# Altium schematic sheet MAX30102_Heart-Rate_Sensor.SchDoc: MAX30102 Heart-Rate Sensor
size A4; DocumentNumber: 9; SheetNumber: 9; SheetTotal: 31
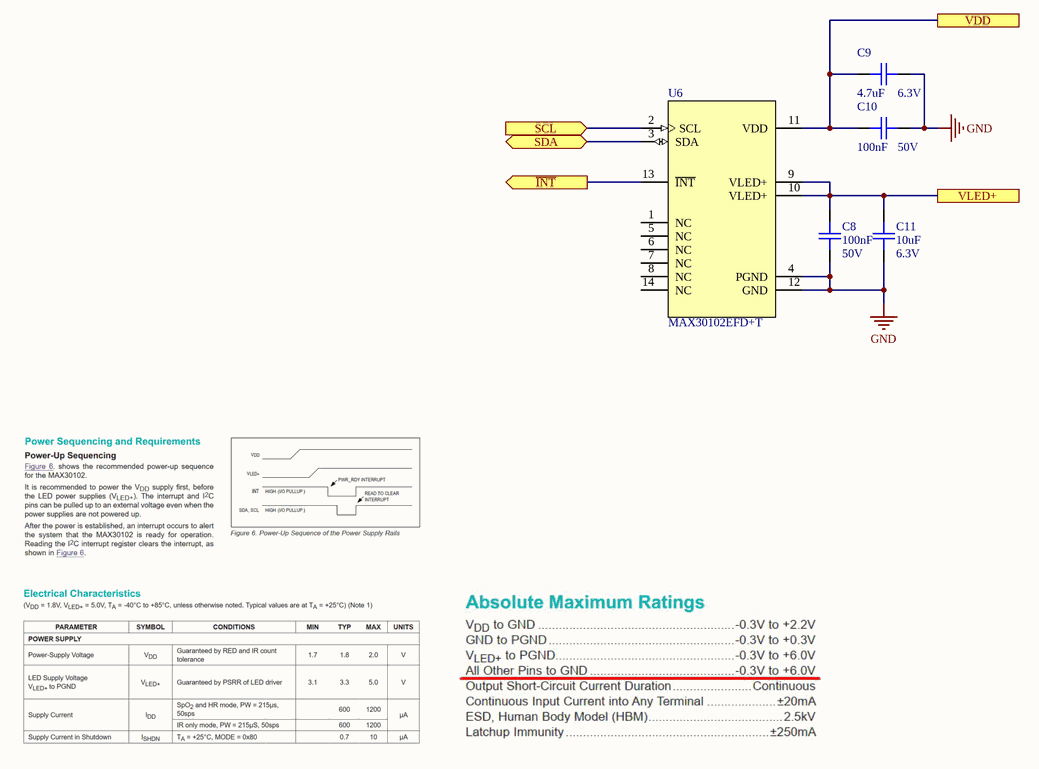
[diagram p0: MAX30102_Heart-Rate_Sensor.SchDoc]

## Parts
C8  Capacitance: 100nF  Voltage: 50V  [C0402]  (hidden comment: CAP CER 0.1UF 50V X7R 0402)
C9  Capacitance: 4.7uF  Voltage Rating: 6.3V  [C0402]  (hidden comment: CAP CER 4.7UF 6.3V X5R 0402)
C10  Capacitance: 100nF  Voltage: 50V  [C0402]  (hidden comment: CAP CER 0.1UF 50V X7R 0402)
C11  Capacitance: 10uF  Voltage Rating: 6.3V  [C0402]  (hidden comment: CAP CER 10UF 6.3V X5R 0402)
U6  MAX30102EFD+T  [XDCR_MAX30101EFD+]

## Ports
SCL (in), SDA (bidir), VDD, VLED+, ~{INT} (out)

## Nets
GND: C8.1 C9.2 C10.2 C11.1 U6.4(PGND) U6.12(GND)
~{INT}: U6.13(~{INT}) ; port ~{INT}
SCL: U6.2(SCL) ; port SCL
SDA: U6.3(SDA) ; port SDA
VDD: C9.1 C10.1 U6.11(VDD) ; port VDD
VLED+: C8.2 C11.2 U6.9(VLED+) U6.10(VLED+) ; port VLED+

Not connected (* = marked no-connect by the designer): U6 1(NC) 5(NC) 6(NC) 7(NC) 8(NC) 14(NC)

## Notes on the sheet
- Title
- Size:
- Date:
- A4
- Number:
- Time:
- Revision:
- Sheet
- of
- File:

## Library data of the parts
C8 C10 = CAP CER 0.1UF 50V X7R 0402: 0.1µF ±10% 50V Ceramic Capacitor X7R 0402 (1005 Metric); Manufacturer: TDK; Manufacturer Part Number: CGA2B3X7R1H104K050BB; Supplier 1: Digi-Key; Stock 1: 2925303; Pricing 1: 1=0.17, 10=0.118, 50=0.0668, 100=0.0553, 500=0.0388, 1000=0.0321, 2500=0.0299, 5000=0.0273 (USD); Mount: Surface Mount; Case/Package: 0402; Weight: 2.3E-05oz; Case Code (Metric): 1005; Case Code (Imperial): 0402; Min Operating Temperature: -55°C; Max Operating Temperature: 125°C; Voltage Rating: 50V; Tolerance: 10%; Packaging: Tape and Reel; Package Quantity: 1; Voltage Rating (DC): 50V; Dielectric: X7R; Termination: SMD/SMT; Composition: Ceramic; Length: 1mm; Height: 0.5mm; Width: 0.02inch; Thickness: 0.022inch; Depth: 0.5mm; Ratings: AEC-Q200; REACH SVHC: No SVHC; Lead Free: Lead Free; ComponentLink1URL: http://product.tdk.com/capacitor/mlcc/en/documents/mlccspec_automotive_general_midvoltage_en.pdf?src-supplier=Future+Electronics; ComponentLink1Description: http://product.tdk.com/capacitor/mlcc/en/documents/mlccspec_automotive_general_midvoltage_en.pdf?src-supplier=Future+Electronics; ComponentLink2URL: http://www.farnell.com/datasheets/1807242.pdf?src-supplier=Element14; ComponentLink2Description: http://www.farnell.com/datasheets/1807242.pdf?src-supplier=Element14; ComponentLink3URL: http://www.mouser.com/ds/2/400/lcc_automotive_general_en-843974.pdf?src-supplier=Mouser; ComponentLink3Description: http://www.mouser.com/ds/2/400/lcc_automotive_general_en-843974.pdf?src-supplier=Mouser; ComponentLink4URL: http://www.farnell.com/datasheets/1936565.pdf?src-supplier=Element14; ComponentLink4Description: http://www.farnell.com/datasheets/1936565.pdf?src-supplier=Element14; ComponentLink5URL: http://www.farnell.com/datasheets/1735392.pdf?src-supplier=Element14; ComponentLink5Description: http://www.farnell.com/datasheets/1735392.pdf?src-supplier=Element14; Supplier Part Number 1: 445-6899-1-ND
C9 = CAP CER 4.7UF 6.3V X5R 0402: 4.7µF ±20% 6.3V Ceramic Capacitor X5R 0402 (1005 Metric); Manufacturer: Samsung; Manufacturer Part Number: CL05A475MQ5NRNC; Supplier 1: Digi-Key; Stock 1: 746765; Pricing 1: 1=0.14, 10=0.099, 50=0.0564, 100=0.0467, 500=0.0327, 1000=0.0271, 2500=0.0252, 5000=0.0231 (USD); Mount: Surface Mount; Case/Package: 0402; Case Code (Metric): 1005; Case Code (Imperial): 0402; Min Operating Temperature: -55°C; Max Operating Temperature: 85°C; Tolerance: 20%; Packaging: Tape and Reel; Series: CL; Length: 0.039inch; Width: 0.02inch; Thickness: 0.022inch; RoHS Compliant: Yes; ComponentLink1URL: https://www.verical.com/server-webapp/html/getDatasheet?partID=359681&src-supplier=Verical; ComponentLink1Description: https://www.verical.com/server-webapp/html/getDatasheet?partID=359681&src-supplier=Verical; ComponentLink2URL: http://www1.futureelectronics.com/doc/SAMSUNG/CL05A475MQ5NRNC.pdf?src-supplier=Future+Electronics; ComponentLink2Description: http://www1.futureelectronics.com/doc/SAMSUNG/CL05A475MQ5NRNC.pdf?src-supplier=Future+Electronics; Supplier Part Number 1: 1276-1056-1-ND
C11 = CAP CER 10UF 6.3V X5R 0402: 10µF ±20% 6.3V Ceramic Capacitor X5R 0402 (1005 Metric); Manufacturer: Samsung; Manufacturer Part Number: CL05A106MQ5NUNC; Supplier 1: Digi-Key; Stock 1: 1544395; Pricing 1: 1=0.27, 10=0.187, 50=0.1248, 100=0.1061, 500=0.0749, 1000=0.0655, 2500=0.0624, 5000=0.0577 (USD); Mount: Surface Mount; Case/Package: 0402; Case Code (Metric): 1005; Case Code (Imperial): 0402; Min Operating Temperature: -55°C; Max Operating Temperature: 85°C; Tolerance: 20%; Dielectric: X5R; Packaging: Tape and Reel; Package Quantity: 1; Series: CL; Construction: Flat; Length: 1mm; Width: 0.02inch; Height: 0.5mm; Thickness: 0.028inch; Depth: 0.5mm; Radiation Hardening: No; ComponentLink1URL: https://www.verical.com/server-webapp/html/getDatasheet?partID=355289&src-supplier=Verical; ComponentLink1Description: https://www.verical.com/server-webapp/html/getDatasheet?partID=355289&src-supplier=Verical; ComponentLink2URL: http://www1.futureelectronics.com/doc/SAMSUNG/CL05A106MQ5NUNC.pdf?src-supplier=Future+Electronics; ComponentLink2Description: http://www1.futureelectronics.com/doc/SAMSUNG/CL05A106MQ5NUNC.pdf?src-supplier=Future+Electronics; Supplier Part Number 1: 1276-1451-1-ND
U6 = IC MAX30102EFD+T INTEGRATED OPTICAL SENSOR: Oximeter/Heart Rate Sensor IÂ²C Output; Manufacturer: Maxim; Output Type: I2C; Supplier 1: Digi-Key; Manufacturer Part Number: MAX30102EFD+T; Stock 1: 4064; Pricing 1: 1=9.76, 10=8.815, 25=8.61 (USD); Min Operating Temperature: -40°C; Max Operating Temperature: 85°C; RoHS Compliant: Yes; ComponentLink1URL: https://datasheets.maximintegrated.com/en/ds/MAX30102.pdf?src-supplier=Digi-Key; ComponentLink1Description: https://datasheets.maximintegrated.com/en/ds/MAX30102.pdf?src-supplier=Digi-Key; Supplier Part Number 1: MAX30102EFD+TCT-ND